# Altium project OCU_r3.PrjPcb
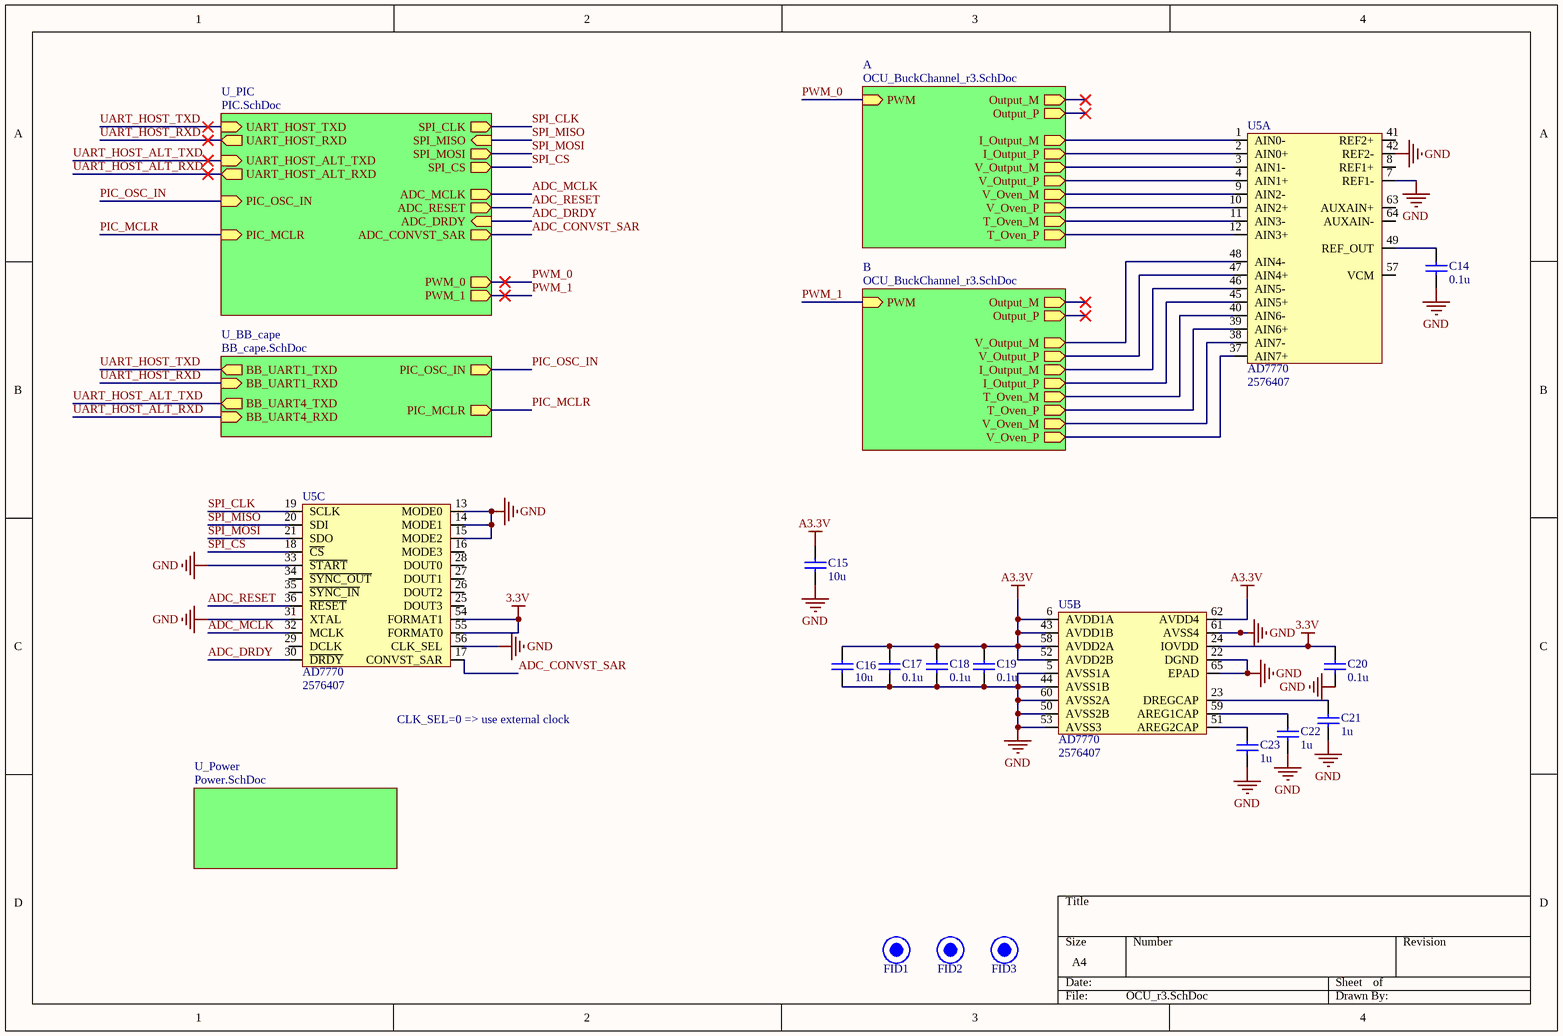
[diagram p0: OCU_r3.SchDoc]
6 sheets, 209 parts. Net scope: hierarchical (ports join the sheet entries above them; power ports are global).
Board file: PCB.PcbDoc
Sheets:
  OCU_r3.SchDoc
    A = OCU_BuckChannel_r3.SchDoc
      _ = Channel_Power.SchDoc
    B = OCU_BuckChannel_r3.SchDoc
      _ = Channel_Power.SchDoc
    U_PIC = PIC.SchDoc
    U_BB_cape = BB_cape.SchDoc
    U_Power = Power.SchDoc

## Sheet OCU_r3.SchDoc
size A4

### Parts
C14  0.1u  [CAPC1608M]
C15  10u  [CAPC2012M]
C16  10u  [CAPC2012M]
C17  0.1u  [CAPC1608M]
C18  0.1u  [CAPC1608M]
C19  0.1u  [CAPC1608M]
C20  0.1u  [CAPC1608M]
C21  1u  [CAPC1608M]
C22  1u  [CAPC1608M]
C23  1u  [CAPC1608M]
FID1  fiducial  [FIDUCIAL]  (value not drawn)  (no BOM)
FID2  fiducial  [FIDUCIAL]  (value not drawn)  (no BOM)
FID3  fiducial  [FIDUCIAL]  (value not drawn)  (no BOM)
U5  AD7770  Supplier Part Number 1: 2576407  [CP-64-15_M]  (parts A,B,C of 3)

### Sub-sheets
A = OCU_BuckChannel_r3.SchDoc: PWM (in), Output_P (out), Output_M (out), I_Output_P (out), T_Oven_P (out), T_Oven_M (out), I_Output_M (out), V_Output_P (out), V_Output_M (out), V_Oven_P (out), V_Oven_M (out)
B = OCU_BuckChannel_r3.SchDoc: PWM (in), Output_P (out), Output_M (out), I_Output_P (out), T_Oven_P (out), T_Oven_M (out), I_Output_M (out), V_Output_P (out), V_Output_M (out), V_Oven_P (out), V_Oven_M (out)
U_BB_cape = BB_cape.SchDoc: BB_UART1_TXD (out), BB_UART1_RXD (in), PIC_OSC_IN (out), PIC_MCLR (out), BB_UART4_TXD (out), BB_UART4_RXD (in)
U_PIC = PIC.SchDoc: UART_HOST_TXD (in), UART_HOST_RXD (out), PIC_OSC_IN (in), SPI_CLK (out), SPI_MOSI (out), SPI_MISO (in), ADC_MCLK (out), SPI_CS (out), ADC_CONVST_SAR (out), ADC_RESET (out), ADC_DRDY (in), PWM_0 (out), PWM_1 (out), PIC_MCLR (in), UART_HOST_ALT_TXD (in), UART_HOST_ALT_RXD (out)
U_Power = Power.SchDoc: no entries

### Nets
3.3V: C20.1 U5.24(IOVDD) U5.54(FORMAT1) U5.55(FORMAT0)
A3.3V: C15.2 C16.2 C17.1 C18.1 C19.1 U5.6(AVDD1A) U5.43(AVDD1B) U5.52(AVDD2B) U5.58(AVDD2A) U5.62(AVDD4)
GND: C14.2 C15.1 C16.1 C17.2 C18.2 C19.2 C20.2 C21.2 C22.2 C23.2 U5.5(AVSS1A) U5.7(REF1-) U5.13(MODE0) U5.14(MODE1) U5.15(MODE2) U5.22(DGND) U5.31(XTAL) U5.33(~{START}) U5.42(REF2-) U5.44(AVSS1B) U5.50(AVSS2B) U5.53(AVSS3) U5.56(CLK_SEL) U5.60(AVSS2A) U5.61(AVSS4) U5.65(EPAD)
ADC_CONVST_SAR: U5.17(CONVST_SAR) ; sheet U_PIC/ADC_CONVST_SAR
ADC_DRDY: U5.30(~{DRDY}) ; sheet U_PIC/ADC_DRDY
ADC_MCLK: U5.32(MCLK) ; sheet U_PIC/ADC_MCLK
ADC_RESET: U5.36(~{RESET}) ; sheet U_PIC/ADC_RESET
ARef: U5.1(AIN0-) U5.3(AIN1-) U5.9(AIN2-) U5.11(AIN3-) ; sheet A/T_Oven_M, sheet A/I_Output_M, sheet A/V_Output_M, sheet A/V_Oven_M
ARef: U5.38(AIN7-) U5.40(AIN6-) U5.46(AIN5-) U5.48(AIN4-) ; sheet B/T_Oven_M, sheet B/I_Output_M, sheet B/V_Output_M, sheet B/V_Oven_M  [a separate net that carries the same name]
PIC_MCLR: sheet U_PIC/PIC_MCLR, sheet U_BB_cape/PIC_MCLR  [project net ~{MCLR}]
PIC_OSC_IN: sheet U_PIC/PIC_OSC_IN, sheet U_BB_cape/PIC_OSC_IN
PWM_0: sheet A/PWM, sheet U_PIC/PWM_0
PWM_1: sheet B/PWM, sheet U_PIC/PWM_1
SPI_CLK: U5.19(SCLK) ; sheet U_PIC/SPI_CLK
SPI_CS: U5.18(~{CS}) ; sheet U_PIC/SPI_CS
SPI_MISO: U5.20(SDI) ; sheet U_PIC/SPI_MISO
SPI_MOSI: U5.21(SDO) ; sheet U_PIC/SPI_MOSI
UART_HOST_ALT_RXD: sheet U_PIC/UART_HOST_ALT_RXD, sheet U_BB_cape/BB_UART4_RXD  [project net PIC_U5TX]
UART_HOST_ALT_TXD: sheet U_PIC/UART_HOST_ALT_TXD, sheet U_BB_cape/BB_UART4_TXD  [project net PIC_U5RX]
UART_HOST_RXD: sheet U_PIC/UART_HOST_RXD, sheet U_BB_cape/BB_UART1_RXD  [project net PIC_U1TX]
UART_HOST_TXD: sheet U_PIC/UART_HOST_TXD, sheet U_BB_cape/BB_UART1_TXD  [project net PIC_U1RX]
NetC14_1: C14.1 U5.49(REF_OUT)
NetC21_1: C21.1 U5.23(DREGCAP)
NetC22_1: C22.1 U5.59(AREG1CAP)
NetC23_1: C23.1 U5.51(AREG2CAP)
NetC143_1: U5.2(AIN0+) ; sheet A/I_Output_P
NetC147_1: U5.10(AIN2+) ; sheet A/V_Oven_P
NetC153_1: U5.12(AIN3+) ; sheet A/T_Oven_P
NetC158_1: U5.4(AIN1+) ; sheet A/V_Output_P
NetC243_1: U5.45(AIN5+) ; sheet B/I_Output_P
NetC247_1: U5.37(AIN7+) ; sheet B/V_Oven_P
NetC253_1: U5.39(AIN6+) ; sheet B/T_Oven_P
NetC258_1: U5.47(AIN4+) ; sheet B/V_Output_P

Not connected (* = marked no-connect by the designer): U5 8(REF1+) 16(MODE3) 25(DOUT3) 26(DOUT2) 27(DOUT1) 28(DOUT0) 29(DCLK) 34(~{SYNC_OUT}) 35(~{SYNC_IN}) 41(REF2+) 57(VCM) 63(AUXAIN+) 64(AUXAIN-)

### Notes on the sheet
- CLK_SEL=0 => use external clock

### Library data of the parts
C14-C23 = C
  C14 C17-C20: Value: 0.1u
  C15 C16: Value: 10u
  C21-C23: Value: 1u
FID1-FID3 = fiducial: fiducial, 1mm diameter
U5 = AD7770: 8-channel 24-bit ADC; Supplier 1: Farnell

## Sheet OCU_BuckChannel_r3.SchDoc
size A4
Used 2 times, as channels A, B. Parts and nets are listed once, with the designators drawn on the sheet.
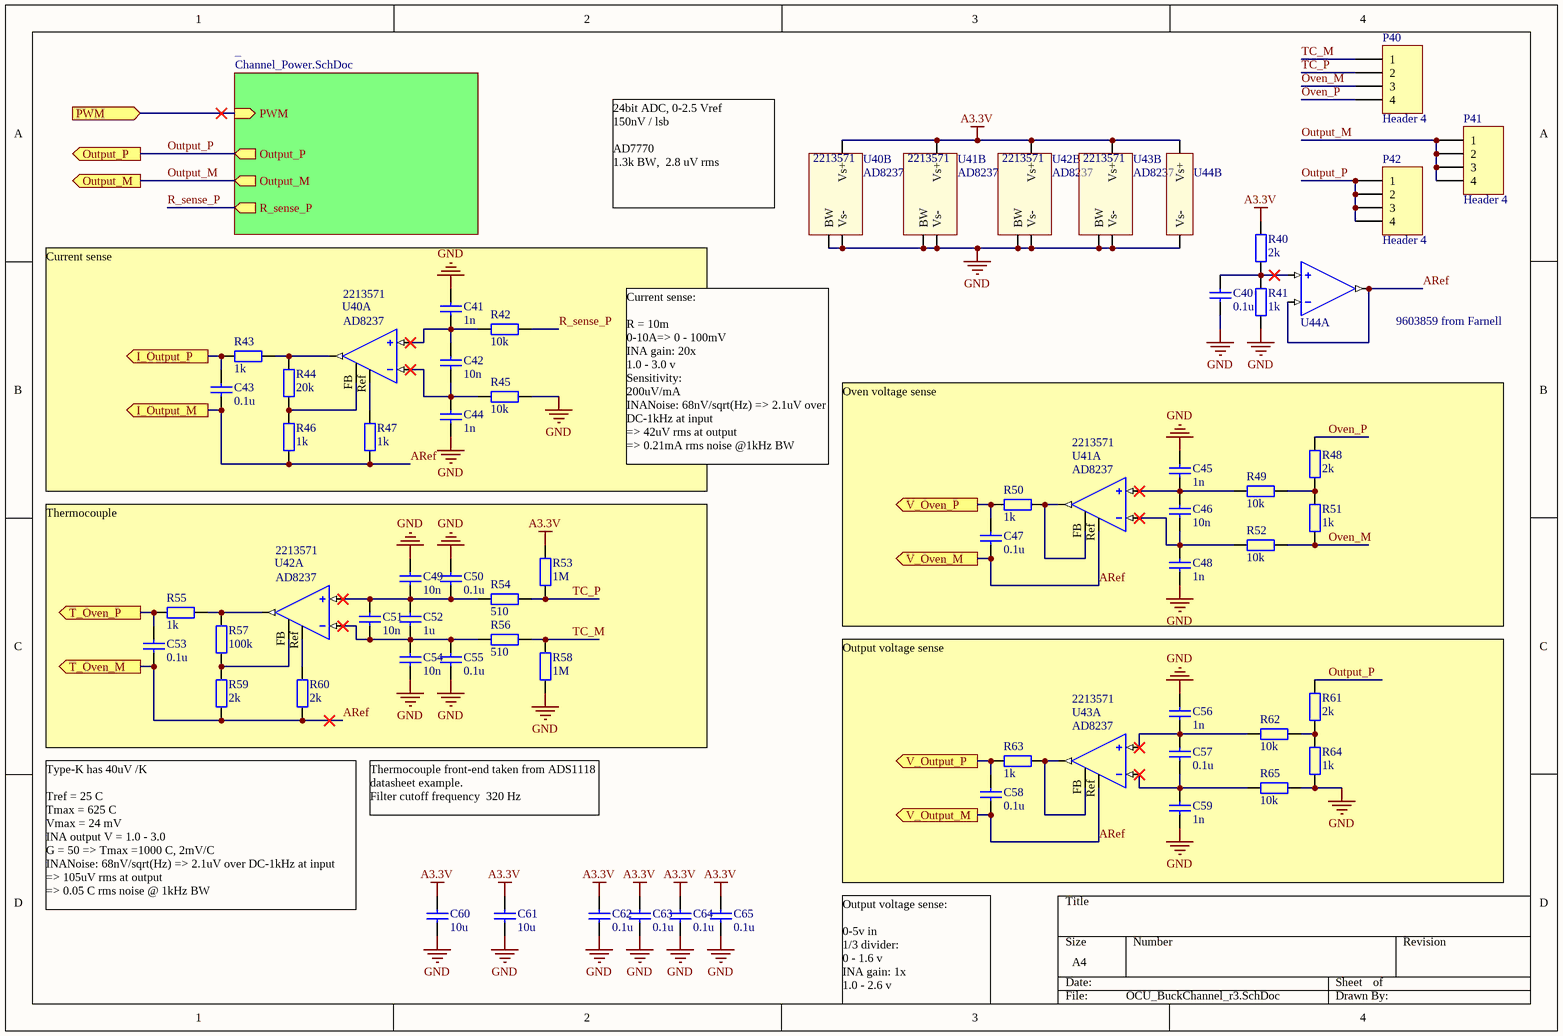
[diagram p1: OCU_BuckChannel_r3.SchDoc]

### Parts
C40  0.1u  [CAPC1608M]
C41  1n  [CAPC1608M]
C42  10n  [CAPC1608M]
C43  0.1u  [CAPC1608M]
C44  1n  [CAPC1608M]
C45  1n  [CAPC1608M]
C46  10n  [CAPC1608M]
C47  0.1u  [CAPC1608M]
C48  1n  [CAPC1608M]
C49  10n  [CAPC1608M]
C50  0.1u  [CAPC1608M]
C51  10n  [CAPC1608M]
C52  1u  [CAPC1608M]
C53  0.1u  [CAPC1608M]
C54  10n  [CAPC1608M]
C55  0.1u  [CAPC1608M]
C56  1n  [CAPC1608M]
C57  0.1u  [CAPC1608M]
C58  0.1u  [CAPC1608M]
C59  1n  [CAPC1608M]
C60  10u  [CAPC2012M]
C61  10u  [CAPC2012M]
C62  0.1u  [CAPC1608M]
C63  0.1u  [CAPC1608M]
C64  0.1u  [CAPC1608M]
C65  0.1u  [CAPC1608M]
P40  Header 4  [HDR1X4]
P41  Header 4  [HDR1X4]
P42  Header 4  [HDR1X4]
R40  2k  [RESC1608M]
R41  1k  [RESC1608M]
R42  10k  [RESC1608M]
R43  1k  [RESC1608M]
R44  20k  [RESC1608M]
R45  10k  [RESC1608M]
R46  1k  [RESC1608M]
R47  1k  [RESC1608M]
R48  2k  [RESC1608M]
R49  10k  [RESC1608M]
R50  1k  [RESC1608M]
R51  1k  [RESC1608M]
R52  10k  [RESC1608M]
R53  1M  [RESC1608M]
R54  510  [RESC1608M]
R55  1k  [RESC1608M]
R56  510  [RESC1608M]
R57  100k  [RESC1608M]
R58  1M  [RESC1608M]
R59  2k  [RESC1608M]
R60  2k  [RESC1608M]
R61  2k  [RESC1608M]
R62  10k  [RESC1608M]
R63  1k  [RESC1608M]
R64  1k  [RESC1608M]
R65  10k  [RESC1608M]
U40  AD8237  Supplier Part Number 1: 2213571  [TSOP65P490-8AM]  (parts A,B of 2)
U41  AD8237  Supplier Part Number 1: 2213571  [TSOP65P490-8AM]  (parts A,B of 2)
U42  AD8237  Supplier Part Number 1: 2213571  [TSOP65P490-8AM]  (parts A,B of 2)
U43  AD8237  Supplier Part Number 1: 2213571  [TSOP65P490-8AM]  (parts A,B of 2)
U44  OpAmp  [SOIC127P600-8M]  (value not drawn)  (parts A,B of 2)

### Sub-sheets
_ = Channel_Power.SchDoc: PWM (in), Output_P (out), Output_M (out), R_sense_P (out)

### Ports
I_Output_M (out), I_Output_P (out), Output_M (out), Output_P (out), PWM (in), T_Oven_M (out), T_Oven_P (out), V_Output_M (out), V_Output_P (out), V_Oven_M (out), V_Oven_P (out)

### Nets
A3.3V: C60.1 C61.1 C62.1 C63.1 C64.1 C65.1 R40.2 R53.2 U40.Vs+ U41.Vs+ U42.Vs+ U43.Vs+ U44.Vs+
GND: C40.2 C41.1 C44.2 C45.1 C48.2 C49.1 C50.1 C54.2 C55.2 C56.1 C59.2 C60.2 C61.2 C62.2 C63.2 C64.2 C65.2 R41.1 R45.2 R58.1 R64.1 R65.2 U40.BW U40.Vs- U41.BW U41.Vs- U42.BW U42.Vs- U43.BW U43.Vs- U44.Vs-
ARef: C43.2 C47.2 C53.2 C58.2 R46.1 R47.1 R59.1 R60.1 U41.Ref U43.Ref U44.In-(-) U44.Out ; port T_Oven_M, port I_Output_M, port V_Output_M, port V_Oven_M
I_Output_P: C43.1 R43.2 ; port I_Output_P
Output_M: P41.1 P41.2 P41.3 P41.4 ; port Output_M, sheet _/Output_M
Output_P: P42.1 P42.2 P42.3 P42.4 R61.2 ; port Output_P, sheet _/Output_P
Oven_M: P40.3 R51.1 R52.2
Oven_P: P40.4 R48.2
PWM: port PWM, sheet _/PWM
R_sense_P: R42.2 ; sheet _/R_sense_P
T_Oven_P: C53.1 R55.2 ; port T_Oven_P
TC_M: P40.1 R56.1 R58.2
TC_P: P40.2 R53.1 R54.1
V_Output_P: C58.1 R63.2 ; port V_Output_P
V_Oven_P: C47.1 R50.2 ; port V_Oven_P
NetC40_1: C40.1 R40.1 R41.2 U44.In+(+)
NetC41_2: C41.2 C42.1 R42.1 U40.In+(+)
NetC42_2: C42.2 C44.1 R45.1 U40.In-(-)
NetC45_2: C45.2 C46.1 R49.1 U41.In+(+)
NetC46_2: C46.2 C48.1 R52.1 U41.In-(-)
NetC49_2: C49.2 C50.2 C51.1 C52.1 R54.2 U42.In+(+)
NetC51_2: C51.2 C52.2 C54.1 C55.1 R56.2 U42.In-(-)
NetC56_2: C56.2 C57.1 R62.1 U43.In+(+)
NetC57_2: C57.2 C59.1 R65.1 U43.In-(-)
NetR43_1: R43.1 R44.2 U40.Out
NetR44_1: R44.1 R46.2 U40.FB
NetR47_2: R47.2 U40.Ref
NetR48_1: R48.1 R49.2 R51.2
NetR50_1: R50.1 U41.FB U41.Out
NetR55_1: R55.1 R57.2 U42.Out
NetR57_1: R57.1 R59.2 U42.FB
NetR60_2: R60.2 U42.Ref
NetR61_1: R61.1 R62.2 R64.2
NetR63_1: R63.1 U43.FB U43.Out

### Channels
A: designators C40=C140 C41=C141 C42=C142 C43=C143 C44=C144 C45=C145 C46=C146 C47=C147 C48=C148 C49=C149 C50=C150 C51=C151 C52=C152 C53=C153 C54=C154 C55=C155 C56=C156 C57=C157 C58=C158 C59=C159 C60=C160 C61=C161 C62=C162 C63=C163 C64=C164 C65=C165 P40=P140 P41=P141 P42=P142 R40=R140 R41=R141 R42=R142 R43=R143 R44=R144 R45=R145 R46=R146 R47=R147 R48=R148 R49=R149 R50=R150 R51=R151 R52=R152 R53=R153 R54=R154 R55=R155 R56=R156 R57=R157 R58=R158 R59=R159 R60=R160 R61=R161 R62=R162 R63=R163 R64=R164 R65=R165 U40=U140 U41=U141 U42=U142 U43=U143 U44=U144; ports I_Output_M=ARef I_Output_P=NetC143_1 Output_M=Output_M_A Output_P=Output_P_A PWM=PWM_0 T_Oven_M=ARef T_Oven_P=NetC153_1 V_Output_M=ARef V_Output_P=NetC158_1 V_Oven_M=ARef V_Oven_P=NetC147_1
B: designators C40=C240 C41=C241 C42=C242 C43=C243 C44=C244 C45=C245 C46=C246 C47=C247 C48=C248 C49=C249 C50=C250 C51=C251 C52=C252 C53=C253 C54=C254 C55=C255 C56=C256 C57=C257 C58=C258 C59=C259 C60=C260 C61=C261 C62=C262 C63=C263 C64=C264 C65=C265 P40=P240 P41=P241 P42=P242 R40=R240 R41=R241 R42=R242 R43=R243 R44=R244 R45=R245 R46=R246 R47=R247 R48=R248 R49=R249 R50=R250 R51=R251 R52=R252 R53=R253 R54=R254 R55=R255 R56=R256 R57=R257 R58=R258 R59=R259 R60=R260 R61=R261 R62=R262 R63=R263 R64=R264 R65=R265 U40=U240 U41=U241 U42=U242 U43=U243 U44=U244; ports I_Output_M=ARef I_Output_P=NetC243_1 Output_M=Output_M_B Output_P=Output_P_B PWM=PWM_1 T_Oven_M=ARef T_Oven_P=NetC253_1 V_Output_M=ARef V_Output_P=NetC258_1 V_Oven_M=ARef V_Oven_P=NetC247_1

### Notes on the sheet
- 24bit ADC, 0-2.5 Vref
  150nV / lsb
  AD7770
  1.3k BW,  2.8 uV rms
- (near U44) 9603859 from Farnell
- Current sense
- Current sense:
  R = 10m
  0-10A=> 0 - 100mV
  INA gain: 20x
  1.0 - 3.0 v
  Sensitivity:
  200uV/mA
  INANoise: 68nV/sqrt(Hz) => 2.1uV over DC-1kHz at input
  => 42uV rms at output
  => 0.21mA rms noise @1kHz BW
- Oven voltage sense
- Thermocouple
- Thermocouple front-end taken from ADS1118 datasheet example.
  Filter cutoff frequency  320 Hz
- Type-K has 40uV /K
  Tref = 25 C
  Tmax = 625 C
  Vmax = 24 mV
  INA output V = 1.0 - 3.0
  G = 50 => Tmax =1000 C, 2mV/C
  INANoise: 68nV/sqrt(Hz) => 2.1uV over DC-1kHz at input
  => 105uV rms at output
  => 0.05 C rms noise @ 1kHz BW
- Output voltage sense
- Output voltage sense:
  0-5v in
  1/3 divider:
  0 - 1.6 v
  INA gain: 1x
  1.0 - 2.6 v

### Library data of the parts
C40-C65 = C
  C40 C43 C47 C50 C53 C55 C57 C58 C62-C65: Value: 0.1u
  C41 C44 C45 C48 C56 C59: Value: 1n
  C42 C46 C49 C51 C54: Value: 10n
  C52: Value: 1u
  C60 C61: Value: 10u
P40-P42 = Header 4: Header, 4-Pin; LatestRevisionDate: 17-Jul-2002; LatestRevisionNote: Re-released for DXP Platform.; Publisher: Altium Limited
R40-R65 = R
  R40 R48 R59-R61: Value: 2k
  R41 R43 R46 R47 R50 R51 R55 R63 R64: Value: 1k
  R42 R45 R49 R52 R62 R65: Value: 10k
  R44: Value: 20k
  R53 R58: Value: 1M
  R54 R56: Value: 510
  R57: Value: 100k
U40-U43 = AD8237: Instrumentation Amplifier; pin to pad: BW>1 FB>7 In+>2 In->3 Out>8 Ref>6 Vs+>5 Vs->4; Supplier 1: Farnell
U44 = OpAmp: Generic Op Amp; pin to pad: In+>3 In->2 Out>6 Vs+>7 Vs->4

## Sheet Channel_Power.SchDoc
size A4
Used 2 times, as channels A/_, B/_. Parts and nets are listed once, with the designators drawn on the sheet.
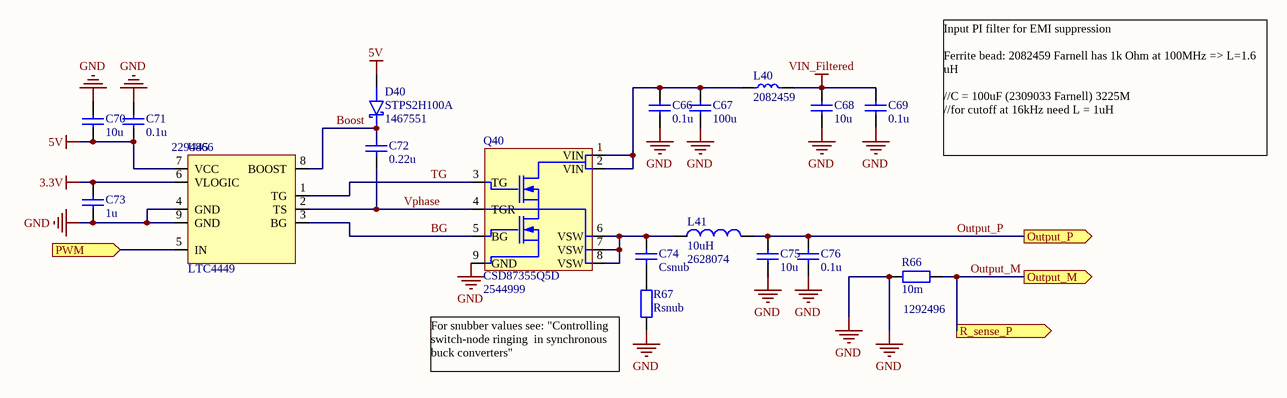
[diagram p2: Channel_Power.SchDoc]

### Parts
C66  0.1u  [CAPC1608M]
C67  100u  [CAPC3225M]
C68  10u  [CAPC2012M]
C69  0.1u  [CAPC1608M]
C70  10u  [CAPC2012M]
C71  0.1u  [CAPC1608M]
C72  0.22u  [CAPC1608M]
C73  1u  [CAPC1608M]
C74  Csnub  [CAPC1608M]
C75  10u  [CAPC2012M]
C76  0.1u  [CAPC1608M]
D40  STPS2H100A  Supplier Part Number 1: 1467551  [DSO-C2/X1.8]
L40  Supplier Part Number 1: 2082459  [WE_742792901]  (hidden comment: Wurth_742792901)
L41  10uH  Supplier Part Number 1: 2628074  [L_XAL1510]
Q40  CSD87355Q5D  Supplier Part Number 1: 2544999  [SON-8]
R66  10m  [RESC6432M]
R67  Rsnub  [RESC1608M]
U45  LTC4449  Supplier Part Number 1: 2294866  [DFN-8]

### Ports
Output_M (out), Output_P (out), PWM (in), R_sense_P (out)

### Nets
3.3V: C73.1 U45.6(VLOGIC)
5V: C70.2 C71.2 D40.A U45.7(VCC)
GND: C66.2 C67.2 C68.2 C69.2 C70.1 C71.1 C73.2 C75.2 C76.2 Q40.9(GND) R66.1 R67.1 U45.4(GND) U45.9(GND)
VIN_Filtered: C68.1 C69.1 L40.2
BG: Q40.5(BG) U45.3(BG)
Boost: C72.1 D40.C U45.8(BOOST)
Output_M: R66.2 ; port Output_M, port R_sense_P
Output_P: C75.1 C76.1 L41.1 ; port Output_P
PWM: U45.5(IN) ; port PWM
TG: Q40.3(TG) U45.1(TG)
Vphase: C72.2 Q40.4(TGR) U45.2(TS)
NetC66_1: C66.1 C67.1 L40.1 Q40.1(VIN) Q40.2(VIN)
NetC74_1: C74.1 L41.2 Q40.6(VSW) Q40.7(VSW) Q40.8(VSW)
NetC74_2: C74.2 R67.2

### Channels
A/_: designators C66=C166 C67=C167 C68=C168 C69=C169 C70=C170 C71=C171 C72=C172 C73=C173 C74=C174 C75=C175 C76=C176 D40=D140 L40=L140 L41=L141 Q40=Q140 R66=R166 R67=R167 U45=U145; ports Output_M=Output_M_A Output_P=Output_P_A PWM=PWM_0 R_sense_P=Output_M_A
B/_: designators C66=C266 C67=C267 C68=C268 C69=C269 C70=C270 C71=C271 C72=C272 C73=C273 C74=C274 C75=C275 C76=C276 D40=D240 L40=L240 L41=L241 Q40=Q240 R66=R266 R67=R267 U45=U245; ports Output_M=Output_M_B Output_P=Output_P_B PWM=PWM_1 R_sense_P=Output_M_B

### Notes on the sheet
- Input PI filter for EMI suppression
  Ferrite bead: 2082459 Farnell has 1k Ohm at 100MHz => L=1.6 uH
  //C = 100uF (2309033 Farnell) 3225M
  //for cutoff at 16kHz need L = 1uH
- (near R66) 1292496
- (near R67) For snubber values see: "Controlling switch-node ringing  in synchronous buck converters"

### Library data of the parts
C66-C76 = C
  C66 C69 C71 C76: Value: 0.1u
  C67: Value: 100u
  C68 C70 C75: Value: 10u
  C72: Value: 0.22u
  C73: Value: 1u
  C74: Value: Csnub
D40 = STPS2H100A: Shottky rectifier; pin to pad: A>1 C>2; Supplier 1: Farnell
L40 = Wurth_742792901: Ferrite bead, 1.1k Ohm, 10A, (Wurth 742792901); Supplier 1: Farnell
L41 = L_XAL1510: XAL1510 Series inductor; Supplier 1: Farnell
Q40 = CSD87355Q5D: Synchronous Buck NexFET Power Block; Supplier 1: Farnell
R66 R67 = R
  R66: Value: 10m
  R67: Value: Rsnub
U45 = LTC4449: High Speed Synchronous N-Channel MOSFET Driver; Supplier 1: Farnell

## Sheet PIC.SchDoc
size A4
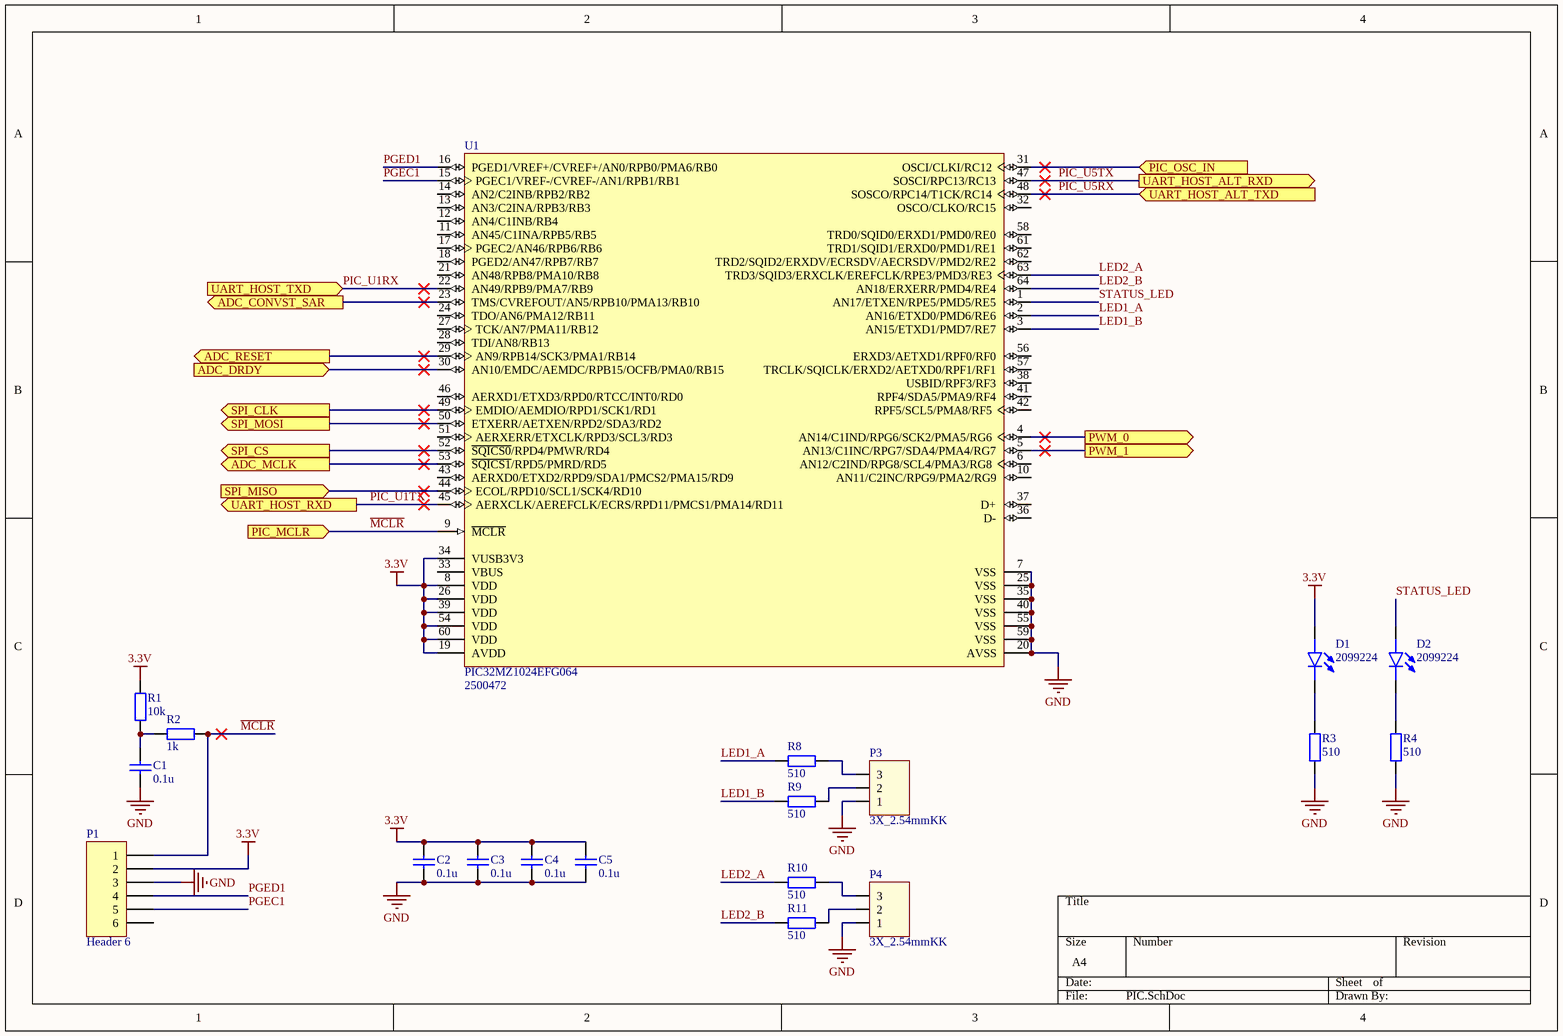
[diagram p3: PIC.SchDoc]

### Parts
C1  0.1u  [CAPC1608M]
C2  0.1u  [CAPC1608M]
C3  0.1u  [CAPC1608M]
C4  0.1u  [CAPC1608M]
C5  0.1u  [CAPC1608M]
D1  Supplier Part Number 1: 2099224  [CD1608-0603]  (hidden comment: KPT-1608SURCK)
D2  Supplier Part Number 1: 2099224  [CD1608-0603]  (hidden comment: KPT-1608SURCK)
P1  Header 6  [HDR1X6]
P3  3X_2.54mmKK  [3X_2.54MM_KK_V]
P4  3X_2.54mmKK  [3X_2.54MM_KK_V]
R1  10k  [RESC1608M]
R2  1k  [RESC1608M]
R3  510  [RESC1608M]
R4  510  [RESC1608M]
R8  510  [RESC1608M]
R9  510  [RESC1608M]
R10  510  [RESC1608M]
R11  510  [RESC1608M]
U1  PIC32MZ1024EFG064  Supplier Part Number 1: 2500472  [MCHP-QFP-PT64_V]

### Ports
ADC_CONVST_SAR (out), ADC_DRDY (in), ADC_MCLK (out), ADC_RESET (out), PIC_MCLR (in), PIC_OSC_IN (in), PWM_0 (out), PWM_1 (out), SPI_CLK (out), SPI_CS (out), SPI_MISO (in), SPI_MOSI (out), UART_HOST_ALT_RXD (out), UART_HOST_ALT_TXD (in), UART_HOST_RXD (out), UART_HOST_TXD (in)

### Nets
3.3V: C2.1 C3.1 C4.1 C5.1 D1.A P1.2 R1.2 U1.8(VDD) U1.19(AVDD) U1.26(VDD) U1.34(VUSB3V3) U1.39(VDD) U1.54(VDD) U1.60(VDD)
GND: C1.2 C2.2 C3.2 C4.2 C5.2 P1.3 P3.1 P4.1 R3.2 R4.2 U1.7(VSS) U1.20(AVSS) U1.25(VSS) U1.35(VSS) U1.40(VSS) U1.55(VSS) U1.59(VSS)
ADC_CONVST_SAR: U1.23(TMS/CVREFOUT/AN5/RPB10/PMA13/RB10) ; port ADC_CONVST_SAR
ADC_DRDY: U1.30(AN10/EMDC/AEMDC/RPB15/OCFB/PMA0/RB15) ; port ADC_DRDY
ADC_MCLK: U1.53(~{SQICS1}/RPD5/PMRD/RD5) ; port ADC_MCLK
ADC_RESET: U1.29(AN9/RPB14/SCK3/PMA1/RB14) ; port ADC_RESET
LED1_A: R8.1 U1.2(AN16/ETXD0/PMD6/RE6)
LED1_B: R9.1 U1.3(AN15/ETXD1/PMD7/RE7)
LED2_A: R10.1 U1.63(TRD3/SQID3/ERXCLK/EREFCLK/RPE3/PMD3/RE3)
LED2_B: R11.1 U1.64(AN18/ERXERR/PMD4/RE4)
~{MCLR}: P1.1 R2.1 U1.9(~{MCLR}) ; port PIC_MCLR
PGEC1: P1.5 U1.15(PGEC1/VREF-/CVREF-/AN1/RPB1/RB1)
PGED1: P1.4 U1.16(PGED1/VREF+/CVREF+/AN0/RPB0/PMA6/RB0)
PIC_OSC_IN: U1.31(OSCI/CLKI/RC12) ; port PIC_OSC_IN
PIC_U1RX: U1.22(AN49/RPB9/PMA7/RB9) ; port UART_HOST_TXD
PIC_U1TX: U1.45(AERXCLK/AEREFCLK/ECRS/RPD11/PMCS1/PMA14/RD11) ; port UART_HOST_RXD
PIC_U5RX: U1.48(SOSCO/RPC14/T1CK/RC14) ; port UART_HOST_ALT_TXD
PIC_U5TX: U1.47(SOSCI/RPC13/RC13) ; port UART_HOST_ALT_RXD
PWM_0: U1.4(AN14/C1IND/RPG6/SCK2/PMA5/RG6) ; port PWM_0
PWM_1: U1.5(AN13/C1INC/RPG7/SDA4/PMA4/RG7) ; port PWM_1
SPI_CLK: U1.49(EMDIO/AEMDIO/RPD1/SCK1/RD1) ; port SPI_CLK
SPI_CS: U1.52(~{SQICS0}/RPD4/PMWR/RD4) ; port SPI_CS
SPI_MISO: U1.44(ECOL/RPD10/SCL1/SCK4/RD10) ; port SPI_MISO
SPI_MOSI: U1.50(ETXERR/AETXEN/RPD2/SDA3/RD2) ; port SPI_MOSI
STATUS_LED: D2.A U1.1(AN17/ETXEN/RPE5/PMD5/RE5)
NetC1_1: C1.1 R1.1 R2.2
NetD1_C: D1.C R3.1
NetD2_C: D2.C R4.1
NetP3_2: P3.2 R9.2
NetP3_3: P3.3 R8.2
NetP4_2: P4.2 R11.2
NetP4_3: P4.3 R10.2

Not connected (* = marked no-connect by the designer): P1 6; U1 6(AN12/C2IND/RPG8/SCL4/PMA3/RG8) 10(AN11/C2INC/RPG9/PMA2/RG9) 11(AN45/C1INA/RPB5/RB5) 12(AN4/C1INB/RB4) 13(AN3/C2INA/RPB3/RB3) 14(AN2/C2INB/RPB2/RB2) 17(PGEC2/AN46/RPB6/RB6) 18(PGED2/AN47/RPB7/RB7) 21(AN48/RPB8/PMA10/RB8) 24(TDO/AN6/PMA12/RB11) 27(TCK/AN7/PMA11/RB12) 28(TDI/AN8/RB13) 32(OSCO/CLKO/RC15) 33(VBUS) 36(D-) 37(D+) 38(USBID/RPF3/RF3) 41(RPF4/SDA5/PMA9/RF4) 42(RPF5/SCL5/PMA8/RF5) 43(AERXD0/ETXD2/RPD9/SDA1/PMCS2/PMA15/RD9) 46(AERXD1/ETXD3/RPD0/RTCC/INT0/RD0) 51(AERXERR/ETXCLK/RPD3/SCL3/RD3) 56(ERXD3/AETXD1/RPF0/RF0) 57(TRCLK/SQICLK/ERXD2/AETXD0/RPF1/RF1) 58(TRD0/SQID0/ERXD1/PMD0/RE0) 61(TRD1/SQID1/ERXD0/PMD1/RE1) 62(TRD2/SQID2/ERXDV/ECRSDV/AECRSDV/PMD2/RE2)

### Library data of the parts
C1-C5 = C: Value: 0.1u
D1 D2 = KPT-1608SURCK: LED, Red, 0603, 20mA; pin to pad: A>1 C>2; Supplier 1: Farnell
P1 = Header 6: Header, 6-Pin; LatestRevisionDate: 17-Jul-2002; LatestRevisionNote: Re-released for DXP Platform.; Publisher: Altium Limited
R1-R4 R8-R11 = R
  R1: Value: 10k
  R2: Value: 1k
  R3 R4 R8-R11: Value: 510
U1 = PIC32MZ1024EFG064: 32-Bit Microcontroller with Audio and Graphics Interfaces, HS USB, Ethernet, and Advanced Analog, 1024 KB Program Memory, 53 I/O Pins, PMP, 64-Pin QFP (PT64); Manufacturer: Microchip; PartNumber: PIC32MZ1024ECG064-E/PT; Packing: Tray; VCC Range: 2.2 to 3.6 V; DatasheetVersion: Rev. B; PackageVersion: C04-085B; PackageReference: QFP-PT64; PackageDescription: 64-Lead Plastic Thin Quad Flatpack, 10 x 10 mm Body, 0.5 mm Pitch; Mounting Technology: Surface Mount; ComponentLink1Description: Manufacturer URL; ComponentLink1URL: http://www.microchip.com/; ComponentLink2Description: Datasheet; ComponentLink2URL: http://ww1.microchip.com/downloads/en/DeviceDoc/60001191B.pdf; ComponentLink3Description: Package Specification; ComponentLink3URL: http://ww1.microchip.com/downloads/en/DeviceDoc/60001191B.pdf; Supplier 1: Farnell

## Sheet BB_cape.SchDoc
size A4
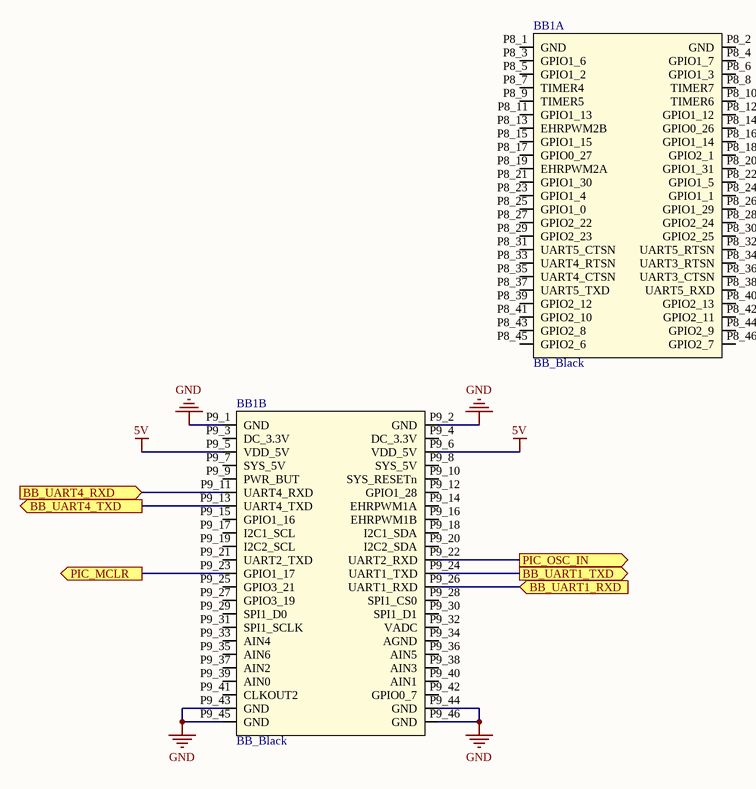
[diagram p4: BB_cape.SchDoc]

### Parts
BB1  BB_Black  [BB_Black_Above]  (parts A,B of 2)

### Ports
BB_UART1_RXD (in), BB_UART1_TXD (out), BB_UART4_RXD (in), BB_UART4_TXD (out), PIC_MCLR (out), PIC_OSC_IN (out)

### Nets
5V: BB1.P9_5(VDD_5V) BB1.P9_6(VDD_5V)
GND: BB1.P9_1(GND) BB1.P9_2(GND) BB1.P9_43(GND) BB1.P9_44(GND) BB1.P9_45(GND) BB1.P9_46(GND)
~{MCLR}: BB1.P9_23(GPIO1_17) ; port PIC_MCLR
PIC_OSC_IN: BB1.P9_22(UART2_RXD) ; port PIC_OSC_IN
PIC_U1RX: BB1.P9_24(UART1_TXD) ; port BB_UART1_TXD
PIC_U1TX: BB1.P9_26(UART1_RXD) ; port BB_UART1_RXD
PIC_U5RX: BB1.P9_13(UART4_TXD) ; port BB_UART4_TXD
PIC_U5TX: BB1.P9_11(UART4_RXD) ; port BB_UART4_RXD

Not connected (* = marked no-connect by the designer): BB1 P8_1(GND) P8_2(GND) P8_3(GPIO1_6) P8_4(GPIO1_7) P8_5(GPIO1_2) P8_6(GPIO1_3) P8_7(TIMER4) P8_8(TIMER7) P8_9(TIMER5) P8_10(TIMER6) P8_11(GPIO1_13) P8_12(GPIO1_12) P8_13(EHRPWM2B) P8_14(GPIO0_26) P8_15(GPIO1_15) P8_16(GPIO1_14) P8_17(GPIO0_27) P8_18(GPIO2_1) P8_19(EHRPWM2A) P8_20(GPIO1_31) P8_21(GPIO1_30) P8_22(GPIO1_5) P8_23(GPIO1_4) P8_24(GPIO1_1) P8_25(GPIO1_0) P8_26(GPIO1_29) P8_27(GPIO2_22) P8_28(GPIO2_24) P8_29(GPIO2_23) P8_30(GPIO2_25) P8_31(UART5_CTSN) P8_32(UART5_RTSN) P8_33(UART4_RTSN) P8_34(UART3_RTSN) P8_35(UART4_CTSN) P8_36(UART3_CTSN) P8_37(UART5_TXD) P8_38(UART5_RXD) P8_39(GPIO2_12) P8_40(GPIO2_13) P8_41(GPIO2_10) P8_42(GPIO2_11) P8_43(GPIO2_8) P8_44(GPIO2_9) P8_45(GPIO2_6) P8_46(GPIO2_7) P9_3(DC_3.3V) P9_4(DC_3.3V) P9_7(SYS_5V) P9_8(SYS_5V) P9_9(PWR_BUT) P9_10(SYS_RESETn) P9_12(GPIO1_28) P9_14(EHRPWM1A) P9_15(GPIO1_16) P9_16(EHRPWM1B) P9_17(I2C1_SCL) P9_18(I2C1_SDA) P9_19(I2C2_SCL) P9_20(I2C2_SDA) P9_21(UART2_TXD) P9_25(GPIO3_21) P9_27(GPIO3_19) P9_28(SPI1_CS0) P9_29(SPI1_D0) P9_30(SPI1_D1) P9_31(SPI1_SCLK) P9_32(VADC) P9_33(AIN4) P9_34(AGND) P9_35(AIN6) P9_36(AIN5) P9_37(AIN2) P9_38(AIN3) P9_39(AIN0) P9_40(AIN1) P9_41(CLKOUT2) P9_42(GPIO0_7)

## Sheet Power.SchDoc
size A4
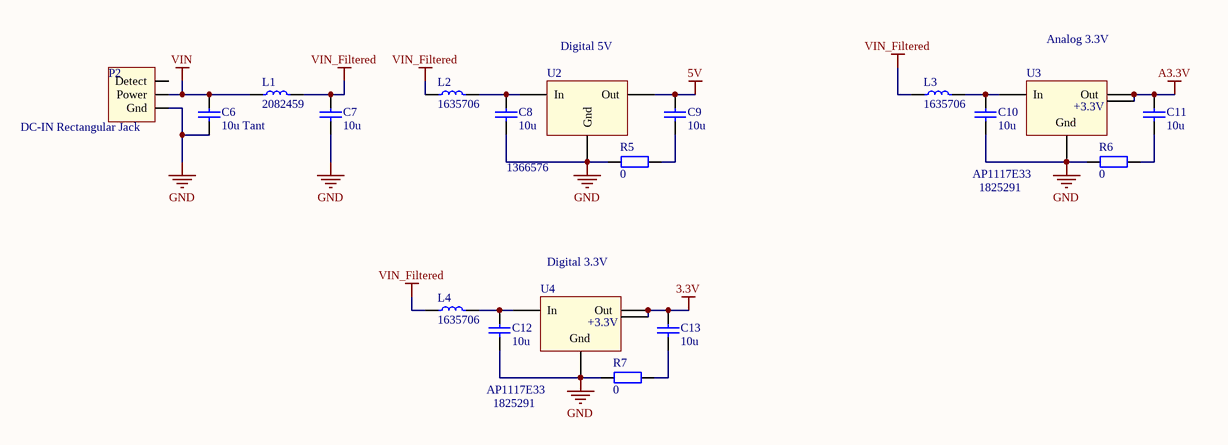
[diagram p5: Power.SchDoc]

### Parts
C6  10u Tant  [CAPC3216M]
C7  10u  [CAPC2012M]
C8  10u  [CAPC2012M]
C9  10u  [CAPC2012M]
C10  10u  [CAPC2012M]
C11  10u  [CAPC2012M]
C12  10u  [CAPC2012M]
C13  10u  [CAPC2012M]
L1  Supplier Part Number 1: 2082459  [WE_742792901]  (hidden comment: Wurth_742792901)
L2  Supplier Part Number 1: 1635706  [INDC1608M]  (hidden comment: FerriteBead_600R)
L3  Supplier Part Number 1: 1635706  [INDC1608M]  (hidden comment: FerriteBead_600R)
L4  Supplier Part Number 1: 1635706  [INDC1608M]  (hidden comment: FerriteBead_600R)
P2  DC-IN Rectangular Jack  [DC-IN-RECT-JACK-PCB]
R5  0  [RESC1608M]
R6  0  [RESC1608M]
R7  0  [RESC1608M]
U2  Supplier Part Number 1: 1366576  [D2PAK_M]  (hidden comment: L7805CD2T-TR)
U3  AP1117E33  Supplier Part Number 1: 1825291  [SOT223-4M]
U4  AP1117E33  Supplier Part Number 1: 1825291  [SOT223-4M]

### Nets
3.3V: C13.2 U4.Out U4.Out2
5V: C9.2 U2.Out
A3.3V: C11.2 U3.Out U3.Out2
GND: C6.2 C7.1 C8.1 C10.1 C12.1 P2.Gnd R5.2 R6.2 R7.2 U2.Gnd U3.Gnd U4.Gnd
VIN: C6.1 L1.1 P2.Power
VIN_Filtered: C7.2 L1.2 L2.1 L3.1 L4.1
NetC8_2: C8.2 L2.2 U2.In
NetC9_1: C9.1 R5.1
NetC10_2: C10.2 L3.2 U3.In
NetC11_1: C11.1 R6.1
NetC12_2: C12.2 L4.2 U4.In
NetC13_1: C13.1 R7.1

Not connected (* = marked no-connect by the designer): P2 Detect

### Notes on the sheet
- (near U2) Digital 5V
- Analog 3.3V
- (near U4) Digital 3.3V
- (in symbol AP1117E33) +3.3V

### Library data of the parts
C6-C13 = C
  C6: Value: 10u Tant
  C7-C13: Value: 10u
L1 = Wurth_742792901: as L40 on sheet Channel_Power; Supplier 1: Farnell
L2-L4 = FerriteBead_600R: Ferrite bead,  600 Ohm, 1A; Supplier 1: Farnell
P2 = DC-IN Rectangular Jack: pin to pad: Detect>DETECT Gnd>GROUND Power>POWER; Supplier 1: Farnell; Supplier Part Number 1: 2507908
R5-R7 = R: Value: 0
U2 = L7805CD2T-TR: 5V 500mA linear regulator, D2PAK-3; pin to pad: Gnd>2 In>1 Out>3; Supplier 1: Farnell
U3 U4 = AP1117E33: 3.3V 1A LDO linear regulator; pin to pad: Gnd>1 In>3 Out>4 Out2>2; Supplier 1: Farnell

## Nets that join several sheets
3.3V: OCU_r3 (C20.1 U5.24 U5.54 U5.55), A/_ (C173.1 U145.6), B/_ (C273.1 U245.6), PIC (14 pins), Power (C13.2 U4.Out U4.Out2)
5V: A/_ (C170.2 C171.2 D140.A U145.7), B/_ (C270.2 C271.2 D240.A U245.7), BB_cape (BB1.P9_5 BB1.P9_6), Power (C9.2 U2.Out)
A3.3V: OCU_r3 (10 pins), A (13 pins), B (13 pins), Power (C11.2 U3.Out U3.Out2)
GND: OCU_r3 (26 pins), A (31 pins), A/_ (14 pins), B (31 pins), B/_ (14 pins), PIC (17 pins), BB_cape (6 pins), Power (12 pins)
VIN_Filtered: A/_ (C168.1 C169.1 L140.2), B/_ (C268.1 C269.1 L240.2), Power (5 pins)
ADC_CONVST_SAR: OCU_r3 (U5.17), PIC (U1.23)
ADC_DRDY: OCU_r3 (U5.30), PIC (U1.30)
ADC_MCLK: OCU_r3 (U5.32), PIC (U1.53)
ADC_RESET: OCU_r3 (U5.36), PIC (U1.29)
ARef: OCU_r3 (U5.1 U5.3 U5.9 U5.11), A (12 pins)
ARef: OCU_r3 (U5.38 U5.40 U5.46 U5.48), B (12 pins)
~{MCLR}: PIC (P1.1 R2.1 U1.9), BB_cape (BB1.P9_23)
NetC143_1: OCU_r3 (U5.2), A (C143.1 R143.2)
NetC147_1: OCU_r3 (U5.10), A (C147.1 R150.2)
NetC153_1: OCU_r3 (U5.12), A (C153.1 R155.2)
NetC158_1: OCU_r3 (U5.4), A (C158.1 R163.2)
NetC243_1: OCU_r3 (U5.45), B (C243.1 R243.2)
NetC247_1: OCU_r3 (U5.37), B (C247.1 R250.2)
NetC253_1: OCU_r3 (U5.39), B (C253.1 R255.2)
NetC258_1: OCU_r3 (U5.47), B (C258.1 R263.2)
Output_M_A: A (5 pins), A/_ (R166.2)
Output_M_B: B (5 pins), B/_ (R266.2)
Output_P_A: A (5 pins), A/_ (C175.1 C176.1 L141.1)
Output_P_B: B (5 pins), B/_ (C275.1 C276.1 L241.1)
PIC_OSC_IN: PIC (U1.31), BB_cape (BB1.P9_22)
PIC_U1RX: PIC (U1.22), BB_cape (BB1.P9_24)
PIC_U1TX: PIC (U1.45), BB_cape (BB1.P9_26)
PIC_U5RX: PIC (U1.48), BB_cape (BB1.P9_13)
PIC_U5TX: PIC (U1.47), BB_cape (BB1.P9_11)
PWM_0: A/_ (U145.5), PIC (U1.4)
PWM_1: B/_ (U245.5), PIC (U1.5)
SPI_CLK: OCU_r3 (U5.19), PIC (U1.49)
SPI_CS: OCU_r3 (U5.18), PIC (U1.52)
SPI_MISO: OCU_r3 (U5.20), PIC (U1.44)
SPI_MOSI: OCU_r3 (U5.21), PIC (U1.50)